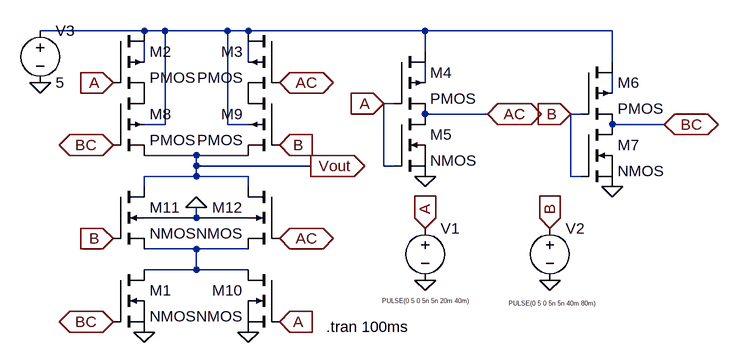
[diagram p0: schematic XOR GATE.asc]
XOR GATE.asc, the LTspice schematic file:
Version 4.1
SHEET 1 880 680
WIRE -80 -144 -240 -144
WIRE -48 -144 -80 -144
WIRE 48 -144 -48 -144
WIRE 80 -144 48 -144
WIRE 352 -144 80 -144
WIRE 640 -144 352 -144
WIRE 352 -112 352 -144
WIRE -80 -96 -80 -128
WIRE 80 -96 80 -128
WIRE 640 -96 640 -144
WIRE 352 -64 352 -96
WIRE 640 -48 640 -80
WIRE 304 -32 288 -32
WIRE 448 -16 352 -16
WIRE 592 -16 576 -16
WIRE -48 0 -48 -144
WIRE -48 0 -80 0
WIRE 48 0 48 -144
WIRE 80 0 48 0
WIRE 720 0 640 0
WIRE 0 48 -80 48
WIRE 80 48 0 48
WIRE 0 64 0 48
WIRE 176 64 0 64
WIRE 288 64 288 -32
WIRE 304 64 288 64
WIRE 0 80 0 64
WIRE 0 80 -80 80
WIRE 80 80 0 80
WIRE 576 80 576 -16
WIRE 592 80 576 80
WIRE -80 96 -80 80
WIRE 80 96 80 80
WIRE 0 144 0 128
WIRE 0 144 -80 144
WIRE 80 144 0 144
WIRE 0 192 -80 192
WIRE 80 192 0 192
WIRE 0 224 0 192
WIRE 0 224 -80 224
WIRE 80 224 0 224
FLAG 544 240 0
FLAG 352 240 0
FLAG -240 -64 0
FLAG 176 64 Vout
IOPIN 176 64 Out
FLAG -80 320 0
FLAG 352 80 0
FLAG 640 96 0
FLAG 80 320 0
FLAG 352 160 A
IOPIN 352 160 In
FLAG 544 160 B
IOPIN 544 160 In
FLAG 576 -16 B
IOPIN 576 -16 In
FLAG 288 -32 A
IOPIN 288 -32 In
FLAG 448 -16 AC
IOPIN 448 -16 BiDir
FLAG 720 0 BC
IOPIN 720 0 BiDir
FLAG -128 32 BC
IOPIN -128 32 BiDir
FLAG -128 304 BC
IOPIN -128 304 BiDir
FLAG -128 -64 A
IOPIN -128 -64 In
FLAG 128 304 A
IOPIN 128 304 In
FLAG 128 -64 AC
IOPIN 128 -64 BiDir
FLAG 128 176 AC
IOPIN 128 176 BiDir
FLAG -128 176 B
IOPIN -128 176 In
FLAG 128 32 B
IOPIN 128 32 In
FLAG 0 128 0
SYMBOL nmos -128 224 R0
SYMATTR InstName M1
SYMBOL voltage 352 144 R0
WINDOW 3 -66 128 Left 0
WINDOW 123 0 0 Left 0
WINDOW 39 0 0 Left 0
SYMATTR Value PULSE(0 5 0 5n 5n 20m 40m)
SYMATTR InstName V1
SYMBOL voltage 544 144 R0
WINDOW 3 -63 132 Left 0
WINDOW 123 0 0 Left 0
WINDOW 39 0 0 Left 0
SYMATTR Value PULSE(0 5 0 5n 5n 40m 80m)
SYMATTR InstName V2
SYMBOL voltage -240 -160 R0
WINDOW 123 0 0 Left 0
WINDOW 39 0 0 Left 0
SYMATTR InstName V3
SYMATTR Value 5
SYMBOL pmos4 -128 -144 R0
SYMATTR InstName M2
SYMBOL pmos4 128 -144 M0
SYMATTR InstName M3
SYMBOL pmos4 304 -112 R0
SYMATTR InstName M4
SYMBOL nmos 304 -16 R0
SYMATTR InstName M5
SYMBOL pmos4 592 -96 R0
SYMATTR InstName M6
SYMBOL nmos 592 0 R0
SYMATTR InstName M7
SYMBOL pmos4 -128 -48 R0
SYMATTR InstName M8
SYMBOL pmos4 128 -48 M0
SYMATTR InstName M9
SYMBOL nmos 128 224 M0
SYMATTR InstName M10
SYMBOL nmos4 -128 96 R0
SYMATTR InstName M11
SYMBOL nmos4 128 96 M0
SYMATTR InstName M12
TEXT 200 312 Left 2 !.tran 100ms

The netlist it stands for:
* XOR GATE.asc
M1 N006 BC 0 0 NMOS
V1 A 0 PULSE(0 5 0 5n 5n 20m 40m)
V2 B 0 PULSE(0 5 0 5n 5n 40m 80m)
V3 N001 0 5
M2 N001 A P001 N002 PMOS
M3 N001 AC P002 N003 PMOS
M4 N001 A AC N004 PMOS
M5 AC A 0 0 NMOS
M6 N001 B BC N005 PMOS
M7 BC B 0 0 NMOS
M8 P001 BC Vout N001 PMOS
M9 P002 B Vout N001 PMOS
M10 N006 A 0 0 NMOS
M11 Vout B N006 0 NMOS
M12 Vout AC N006 0 NMOS
.model NMOS NMOS
.model PMOS PMOS
.lib standard.mos
.tran 100ms
.backanno
.end